# EAGLE design Aeroponics Control (EAGLE 9.6.2)
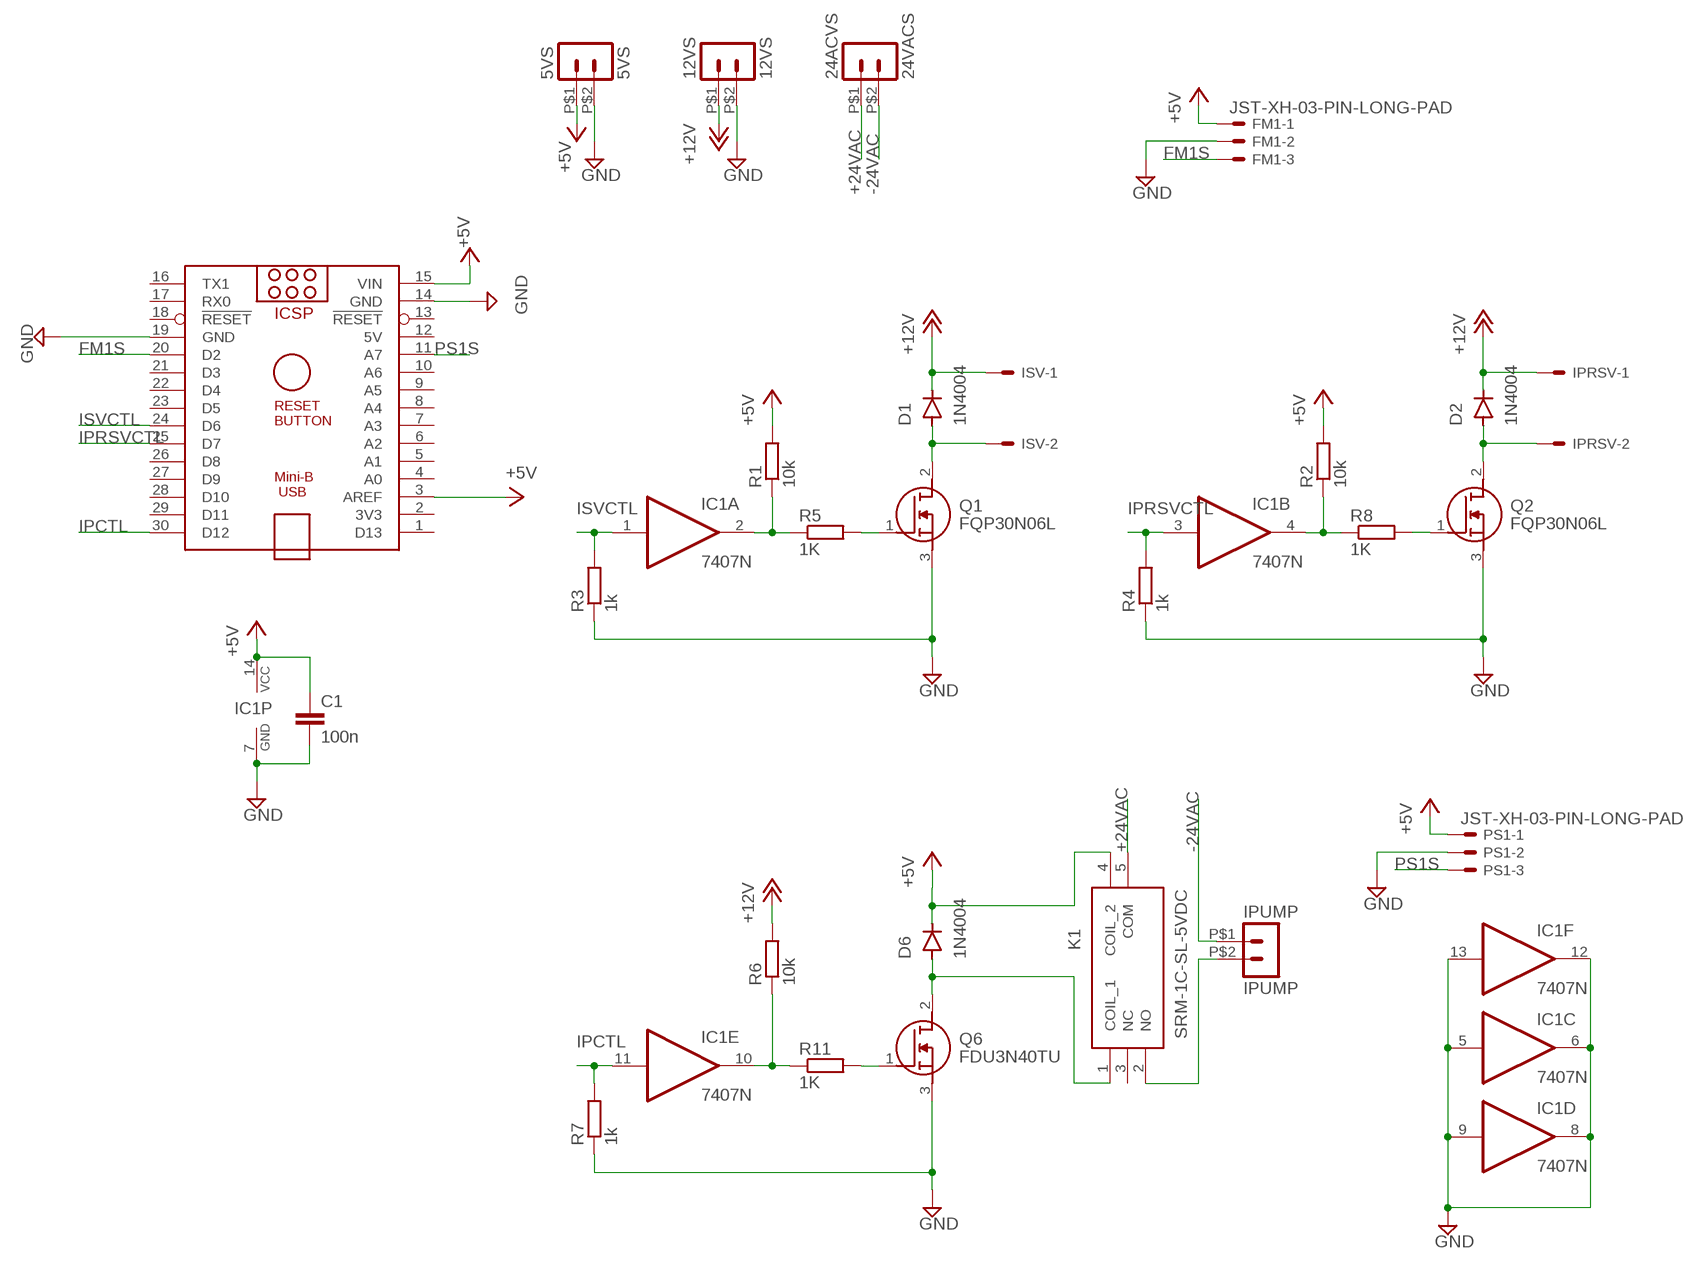
[diagram p0: schematic, sheet 1]

## Parts
5VS  5VS  HEADER_POS2_43650-0215  [43650-0215]
12VS  12VS  HEADER_POS2_43650-0215  [43650-0215]
24ACVS  24VACS  HEADER_POS2_43650-0215  [43650-0215]
C1  100n  C-EU050-024X044  [C050-024X044]
D1  1N4004  [DO-41]
D2  1N4004  [DO-41]
D6  1N4004  [DO-41]
FM1  JST-XH-03-PIN-LONG-PAD  [JST-XH-03-PACKAGE-LONG-PAD]
IC1  7407N  [DIL14]
IPRSV  JST-XH-02-PIN-LONG-PAD  [JST-XH-02-PACKAGE-LONG-PAD]
IPUMP  IPUMP  HEADER_POS2_43650-0215  [43650-0215]
ISV  JST-XH-02-PIN-LONG-PAD  [JST-XH-02-PACKAGE-LONG-PAD]
K1  SRM-1C-SL-5VDC  [SRM1CSL5VDC]
PCB1  ARDUINO_NANOARDUINO_NANO_HEADERS  ARDUINO_NANO  [ARDUINO_NANO]
PS1  JST-XH-03-PIN-LONG-PAD  [JST-XH-03-PACKAGE-LONG-PAD]
Q1  FQP30N06L  [TO254P470X1016X2019-3P]
Q2  FQP30N06L  [TO254P470X1016X2019-3P]
Q6  FDU3N40TU  [TO229P250X658X985-3P]
R1  10k  R-EU_0204/7  [0204/7]
R2  10k  R-EU_0204/7  [0204/7]
R3  1k  R-EU_0204/7  [0204/7]
R4  1k  R-EU_0204/7  [0204/7]
R5  1K  R-EU_0204/7  [0204/7]
R6  10k  R-EU_0204/7  [0204/7]
R7  1k  R-EU_0204/7  [0204/7]
R8  1K  R-EU_0204/7  [0204/7]
R11  1K  R-EU_0204/7  [0204/7]

## Nets
+5V [5V]: 5VS.P$1 C1.1 D6.C FM1.1 IC1.14(P:VCC) K1.4(COIL_2) PCB1.3(AREF) PCB1.15(VIN) PS1.1 R1.2 R2.2
+12V [12V]: 12VS.P$1 D1.C D2.C IPRSV.1 ISV.1 R6.2
+24VAC [24VAC]: 24ACVS.P$1 K1.5(COM)
-24VAC [24VAC]: 24ACVS.P$2 IPUMP.P$1
FM1S: FM1.3 PCB1.20(D2)
GND: 5VS.P$2 12VS.P$2 C1.2 FM1.2 IC1.5(C:I) IC1.6(C:O) IC1.7(P:GND) IC1.8(D:O) IC1.9(D:I) IC1.12(F:O) IC1.13(F:I) PCB1.14(GND) PCB1.19(GND) PS1.2 Q1.3(S) Q2.3(S) Q6.3(S) R3.1 R4.1 R7.1
IPCTL: IC1.11(E:I) PCB1.30(D12) R7.2
IPRSVCTL: IC1.3(B:I) PCB1.25(D7) R4.2
ISVCTL: IC1.1(A:I) PCB1.24(D6) R3.2
N$1 [Solenoids]: D2.A IPRSV.2 Q2.2(D)
N$3: IC1.2(A:O) R1.1 R5.1
N$4: Q2.1(G) R8.2
N$5: Q1.1(G) R5.2
N$7 [24VAC]: IPUMP.P$2 K1.2(NO)
N$9: IC1.4(B:O) R2.1 R8.1
N$10 [Solenoids]: D1.A ISV.2 Q1.2(D)
N$13: Q6.1(G) R11.2
N$17: IC1.10(E:O) R6.1 R11.1
N$21: D6.A K1.1(COIL_1) Q6.2(D)
PS1S: PCB1.11(A7) PS1.3
Unconnected: K1.3(NC) PCB1.1(D13) PCB1.2(3V3) PCB1.4(A0) PCB1.5(A1) PCB1.6(A2) PCB1.7(A3) PCB1.8(A4) PCB1.9(A5) PCB1.10(A6) PCB1.13(!RESET) PCB1.16(TX1) PCB1.17(RX0) PCB1.18(!RESET) PCB1.21(D3) PCB1.22(D4) PCB1.23(D5) PCB1.26(D8) PCB1.27(D9) PCB1.28(D10) PCB1.29(D11)

## Power pins joined to a net without a drawn wire
5V: PCB1.12(5V)

## Library data of the parts
5VS 12VS 24ACVS IPUMP = Aeroponics Control:HEADER_POS2_?: Molex - Micro-Fit 3.0 Series connector, 3.00mm (0.118") pitch header, 2 positions.
C1 = Aeroponics Control:C-EU: CAPACITOR, European symbol
D1 D2 D6 = Aeroponics Control:1N4004: DIODE GEN PURP 400V 1A DO41 Manufacturer's datasheet <https://www.mccsemi.com/pdf/Products/1N4001-1N4007(DO-41).pdf>; CREATED_BY: PCBLayout.com; DIGIKEY_PART_NUMBER: 1N4004MSCT-ND; MANUFACTURER: Micro Commercial Co; MPN: 1N4004; PACKAGE: DO-41
FM1 PS1 = Aeroponics Control:JST-XH-03-PIN: JST XH Connector 2 Pin Wire to board connector. Pitch: 2,54 mm, (0.100") Number of pins: 3 Created by Rembrandt Electronics www.rembrandtelectronics.com
IC1 = Aeroponics Control:74*07: Hex BUFFER, open collector high-voltage output
IPRSV ISV = Aeroponics Control:JST-XH-02-PIN: JST XH Connector 2 Pin Wire to board connector. Pitch: 2,54 mm, (0.100") Number of pins: 2 Created by Rembrandt Electronics www.rembrandtelectronics.com
K1 = Aeroponics Control:SRM-1C-SL-5VDC: IMO PRECISION CONTROLS - SRM-1C-SL-5VDC - RELAY, SPDT, 277VAC, 250VDC, 10A Source: Datasheet <https://componentsearchengine.com/Datasheets/2/SRM-1C-SL-5VDC.pdf>; DESCRIPTION: IMO PRECISION CONTROLS - SRM-1C-SL-5VDC - RELAY, SPDT, 277VAC, 250VDC, 10A; HEIGHT: 15.5mm; MANUFACTURER_NAME: IMO PRECISION CONTROLS; MANUFACTURER_PART_NUMBER: SRM-1C-SL-5VDC
PCB1 = Aeroponics Control:ARDUINO_NANO: Arduino Nano V3.0 Overview: The Arduino Nano is a small, complete, and breadboard-friendly board based on the ATmega328 (Arduino Nano 3.x) or ATmega168 (Arduino Nano 2.x). It has more or less the same functionality of the Arduino Duemilanove, but in a different package. It lacks only a DC power jack, and works with a Mini-B USB cable instead of a standard one. The Nano was designed and is being produced by Gravitech. Specifications: Microcontroller Atmel ATmega168 or ATmega328 Operating Voltage (logic level) 5 V Input Voltage (recommended) 7-12 V Input Voltage (limits) 6-20 V Digital I/O Pins 14 (of which 6 provide PWM output) Analog Input Pins 8 DC Current per I/O Pin 40 mA Flash Memory 16 KB (ATmega168) or 32 KB (ATmega328) of which 2 KB used by bootloader SRAM 1 KB (ATmega168) or 2 KB (ATmega328) EEPROM 512 bytes (ATmega168) or 1 KB (ATmega328) Clock Speed 16 MHz Dimensions 0.73" x 1.70" Length 45 mm Width 18 mm Weigth 5 g Power: The Arduino Nano can be powered via the Mini-B USB connection, 6-20V unregulated external power supply (pin 30), or 5V regulated external power supply (pin 27). The power source is automatically selected to the highest voltage source. Memory: The ATmega168 has 16 KB of flash memory for storing code (of which 2 KB is used for the bootloader); the ATmega328 has 32 KB, (also with 2 KB used for the bootloader). The ATmega168 has 1 KB of SRAM and 512 bytes of EEPROM (which can be read and written with the EEPROM library); the ATmega328 has 2 KB of SRAM and 1 KB of EEPROM. Input and Output: Each of the 14 digital pins on the Nano can be used as an input or output, using pinMode(), digitalWrite(), and digitalRead() functions. They operate at 5 volts. Each pin can provide or receive a maximum of 40 mA and has an internal pull-up resistor (disconnected by default) of 20-50 kOhms. In addition, some pins have specialized functions. Visit Arduino - ArduinoBoardNano <https://www.arduino.cc/en/Main/ArduinoBoardNano>
Q1 Q2 = Aeroponics Control:FQP30N06L: FQP30N06L N-Channel MOSFET, 32 A, 60 V QFET, 3-Pin TO-220 ON Semiconductor Source: Datasheet <http://uk.rs-online.com/web/p/products/8075863P>; DESCRIPTION: FQP30N06L N-Channel MOSFET, 32 A, 60 V QFET, 3-Pin TO-220 ON Semiconductor; HEIGHT: 4.7mm; MANUFACTURER_NAME: onsemi; MANUFACTURER_PART_NUMBER: FQP30N06L; RS_PART_NUMBER: 8075863P; RS_PRICE-STOCK: http://uk.rs-online.com/web/p/products/8075863P
Q6 = Aeroponics Control:FDU3N40TU: Fairchild FDU3N40TU N-channel MOSFET Transistor, 2 A, 400 V, 3-Pin IPAK Source: Datasheet <http://uk.rs-online.com/web/p/products/8070701P>; DESCRIPTION: Fairchild FDU3N40TU N-channel MOSFET Transistor, 2 A, 400 V, 3-Pin IPAK; HEIGHT: 2.5mm; MANUFACTURER_NAME: onsemi; MANUFACTURER_PART_NUMBER: FDU3N40TU; RS_PART_NUMBER: 8070701P; RS_PRICE-STOCK: http://uk.rs-online.com/web/p/products/8070701P
R1-R8 R11 = Aeroponics Control:R-EU_: RESISTOR, European symbol

## Net classes
0 default: width 0.203 mm, clearance 0.254 mm
1 240VAC: width 0.254 mm, drill 0.254 mm, clearance 0.508 mm to class 0, clearance 0.508 mm
2 24VAC: width 0.762 mm, drill 0.762 mm, clearance 0.508 mm to class 0, clearance 0.508 mm to class 1, clearance 0.508 mm
3 5V: width 0.508 mm, drill 0.508 mm, clearance 0.254 mm to class 0, clearance 0.254 mm to class 1, clearance 0.254 mm to class 2, clearance 0.254 mm
4 12V: width 2.032 mm, drill 2.032 mm, clearance 0.254 mm to class 0, clearance 0.254 mm to class 1, clearance 0.254 mm to class 2, clearance 0.254 mm to class 3, clearance 0.254 mm
5 Pumps: width 0.762 mm, drill 0.762 mm, clearance 0.254 mm to class 0, clearance 0.254 mm to class 1, clearance 0.254 mm to class 2, clearance 0.254 mm to class 3, clearance 0.254 mm to class 4, clearance 0.254 mm
6 Solenoids: width 0.254 mm, drill 0.254 mm, clearance 0.254 mm to class 0, clearance 0.254 mm to class 1, clearance 0.254 mm to class 2, clearance 0.254 mm to class 3, clearance 0.254 mm to class 4, clearance 0.254 mm to class 5, clearance 0.254 mm

## Board
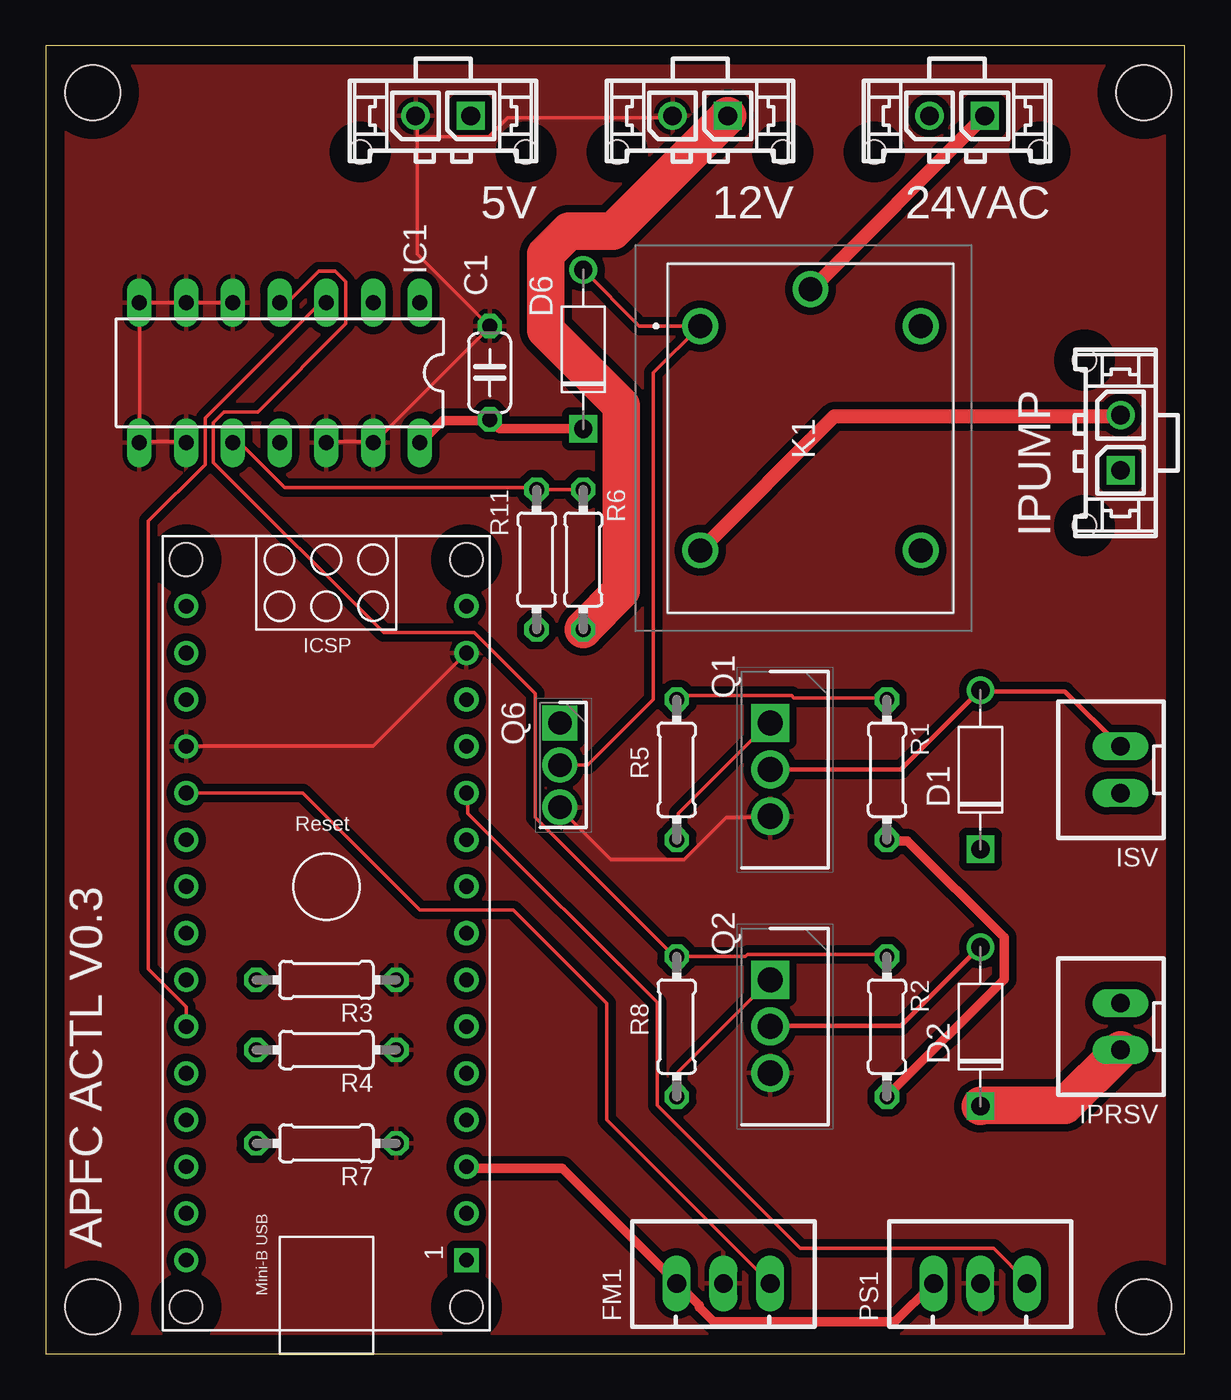
[diagram p1: board, top side]
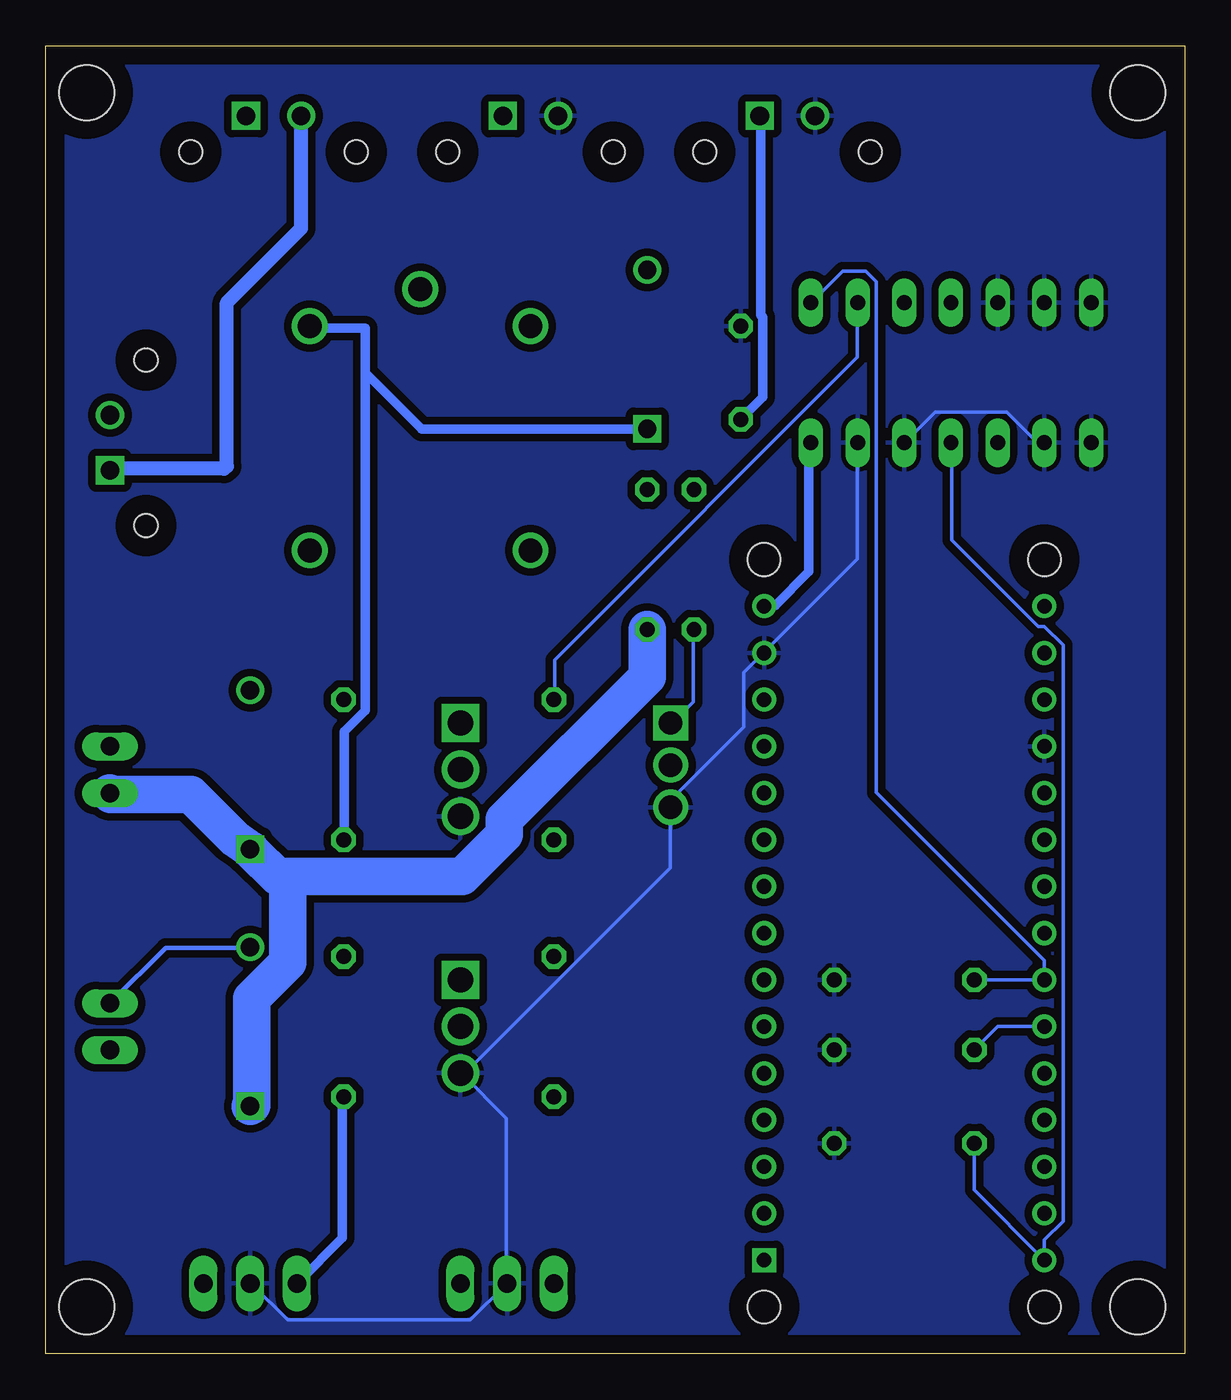
[diagram p2: board, bottom side, seen from below]

Size 61.9 x 71.11 mm. Coordinates in mm from the lower left corner, seen from the top.
Outline: 0,0 61.9,0 61.9,71.11 0,71.11 0,0
Copper layers (1*16): Top 0.035mm / dielectric 1.5mm / Bottom 0.035mm
Design rules "default": minimum track width 6mil, minimum drill 0.35mm, track to track 6mil, track to pad 6mil, pad to pad 6mil, via to via 6mil, smd to smd 6mil, copper to edge 40mil, drill to drill 6mil, minimum pad ring 10mil, minimum via ring 8mil, stop-mask expansion 4mil, vias tented up to drill 0mil, thermal gap 10mil
Holes 3 mm at 2.54,68.58 59.69,68.58 59.69,2.54 2.54,2.54

### Footprints (pad centres in the part's own frame; a part is rotated, then mirrored left to right if it is on the bottom)
43650-0215 = drill 1.02 square: P$1 1.5,0 | drill 1.02: P$2 -1.5,0 | hole 1.27: 4.5,-1.96; -4.5,-1.96
C050-024X044 = drill 0.813 octagon: 1 -2.54,0; 2 2.54,0
DO-41 = drill 1: A 4.325,0 | drill 1 square: C -4.325,0
JST-XH-03-PACKAGE-LONG-PAD = drill 1.016 long: 1 -2.54,0; 2 0,0; 3 2.54,0
DIL14 = drill 0.813 long: 1 -7.62,-3.81; 2 -5.08,-3.81; 3 -2.54,-3.81; 4 0,-3.81; 5 2.54,-3.81; 6 5.08,-3.81; 7 7.62,-3.81; 8 7.62,3.81; 9 5.08,3.81; 10 2.54,3.81; 11 0,3.81; 12 -2.54,3.81; 13 -5.08,3.81; 14 -7.62,3.81
JST-XH-02-PACKAGE-LONG-PAD = drill 1.016 long: 1 -1.27,0; 2 1.27,0
SRM1CSL5VDC = drill 1.3 pad 1.95: 1 0,0; 2 12.2,0; 3 12.2,12; 4 0,12; 5 -2,6
ARDUINO_NANO = drill 0.8 square: 1 -20.32,-7.62 | drill 0.8: 2 -17.78,-7.62; 3 -15.24,-7.62; 4 -12.7,-7.62; 5 -10.16,-7.62; 6 -7.62,-7.62; 7 -5.08,-7.62; 8 -2.54,-7.62; 9 0,-7.62; 10 2.54,-7.62; 11 5.08,-7.62; 12 7.62,-7.62; 13 10.16,-7.62; 14 12.7,-7.62; 15 15.24,-7.62; 16 15.24,7.62; 17 12.7,7.62; 18 10.16,7.62; 19 7.62,7.62; 20 5.08,7.62; 21 2.54,7.62; 22 0,7.62; 23 -2.54,7.62; 24 -5.08,7.62; 25 -7.62,7.62; 26 -10.16,7.62; 27 -12.7,7.62; 28 -15.24,7.62; 29 -17.78,7.62; 30 -20.32,7.62 | hole 1.778: -22.86,-7.62; -22.86,7.62; 17.78,7.62; 17.78,-7.62
TO254P470X1016X2019-3P = drill 1.37 pad 2.055 square: 1 0,0 | drill 1.37 pad 2.055: 2 2.535,0; 3 5.07,0
TO229P250X658X985-3P = drill 1.27 pad 1.905 square: 1 0,0 | drill 1.27 pad 1.905: 2 2.29,0; 3 4.58,0
0204/7 = drill 0.813 octagon: 1 -3.81,0; 2 3.81,0

### Placement (x,y rotation side)
5VS  21.59,67.31 0 top
12VS  35.56,67.31 0 top
24ACVS  49.53,67.31 0 top
C1  24.13,53.34 90 top
D1  50.8,31.75 90 top
D2  50.8,17.78 90 top
D6  29.21,54.61 90 top
FM1  36.83,3.81 0 top
IC1  12.7,53.34 180 top
IPRSV  58.42,17.78 90 top
IPUMP  58.42,49.53 270 top
ISV  58.42,31.75 90 top
K1  35.56,55.88 270 top
PCB1  15.24,25.4 90 top
PS1  50.8,3.81 0 top
Q1  39.37,34.29 270 top
Q2  39.37,20.32 270 top
Q6  27.94,34.29 270 top
R1  45.72,31.75 270 top
R2  45.72,17.78 270 top
R3  15.24,20.32 180 top
R4  15.24,16.51 180 top
R5  34.29,31.75 270 top
R6  29.21,43.18 270 top
R7  15.24,11.43 180 top
R8  34.29,17.78 270 top
R11  26.67,43.18 270 top

### Tracks (layer width: path | path; a pad name or v marks a point on that pad's centre or on a via)
+5V
  Top 0.508: PCB1.3 22.94,10.06 28.08,10.06 34.25,3.89 FM1.1 34.48,3.66 35.51,2.63 35.51,2.52 36.31,1.71 46.14,1.71 48.2,3.77 PS1.1 | R1.2 45.8,27.89 46.82,27.89 52.08,22.63 52.08,20.34 45.8,14.06 R2.2 | IC1.14 20.42,49.61 21.56,50.75 24.08,50.75 C1.1 24.31,50.63 24.65,50.29 29.11,50.29 D6.C
  Bottom 0.508: R2.2 45.8,13.95 45.8,6.29 48.2,3.89 PS1.1 | PCB1.15 22.82,40.69 22.25,40.69 20.42,42.52 20.42,49.49 IC1.14 | 5VS.P$1 23.05,67.21 23.05,56.46 22.94,56.35 22.94,52.01 24.08,50.86 C1.1 | K1.4 47.51,55.78 44.54,55.78 44.54,55.55 44.54,53.34 | 44.54,53.34 44.54,34.98 45.68,33.83 45.68,28 R1.2 | D6.C 41.48,50.28 44.54,53.34
+12V
  Top 2.032: D2.C 50.82,13.49 55.4,13.49 58.37,16.46 IPRSV.1 | 12VS.P$1 36.99,67.21 30.82,61.04 28.42,61.04 27.16,59.78 27.16,55.66 31.28,51.55 31.28,41.49 29.22,39.43 R6.2
  Bottom 2.032: 48.77,25.95 49.34,25.95 50.71,27.32 D1.C 51.62,28 54.03,30.4 58.37,30.4 ISV.1 | 48.77,25.95 39.28,25.95 36.99,28.23 36.99,29.03 29.22,36.8 29.22,39.32 R6.2 | D2.C 50.71,13.49 50.71,19.32 48.77,21.26 48.77,25.03 48.77,25.95
+24VAC
  Top 0.762: 24ACVS.P$1 50.94,67.21 41.57,57.84 K1.5
-24VAC
  Bottom 0.762: IPUMP.P$1 58.37,48.12 52.21,48.12 52.07,48.26 52.07,57.15 48.03,61.19 24ACVS.P$2
FM1S
  Top 0.203: PCB1.20 13.97,30.48 20.32,24.13 25.4,24.13 30.48,19.05 30.48,12.7 FM1.3
GND
  Top 0.203: 5.1,49.61 7.62,49.61 IC1.9 | 5.1,49.61 IC1.8 5.1,49.61 | 5.1,57.15 IC1.6 10.13,57.15 IC1.5 | 5.1,57.15 IC1.7 5.1,57.15 | 5.1,57.15 5.1,49.61 | IC1.12 15.28,49.61 17.68,49.61 IC1.13 17.79,49.49 24.08,55.78 C1.2 24.08,55.89 20.19,59.78 20.19,66.18 | 20.19,66.18 20.19,67.21 5VS.P$2 | 20.19,66.18 24.08,66.18 25.11,67.21 34.02,67.21 12VS.P$2 | PCB1.19 7.62,33.03 17.79,33.03 22.82,38.06 PCB1.14 | Q1.3 39.28,29.15 36.99,29.15 34.71,26.86 30.71,26.86 27.96,29.6 Q6.3
  Bottom 0.203: IC1.9 7.62,49.61 8.08,49.61 9.68,51.21 13.56,51.21 15.16,49.61 IC1.12 | PS1.2 50.71,3.77 48.77,1.83 38.82,1.83 36.88,3.77 FM1.2 36.88,3.89 36.88,12.8 39.28,15.2 Q2.3 39.17,15.2 27.96,26.4 27.96,29.6 Q6.3 27.85,29.72 27.85,30.18 23.96,34.06 23.96,37.03 22.94,38.06 PCB1.14 22.82,38.18 17.79,43.2 17.79,49.49 IC1.13
  pour Top (isolate 0.406): 0,71.12 62.23,71.12 62.23,0 0,0
  pour Bottom (isolate 0.406): 0,71.12 62.23,71.12 62.23,0 0,0
IPCTL
  Bottom 0.203: IC1.11 12.65,49.49 12.65,44.23 7.96,39.55 7.62,39.55 6.59,38.52 6.59,7.2 7.62,6.17 7.62,5.14 PCB1.30 11.43,8.89 R7.2
IPRSVCTL
  Top 0.203: PCB1.25 7.62,17.83 7.62,18.86 5.56,20.92 5.56,45.26 8.65,48.35 8.65,50.86 14.93,57.15 15.16,57.15 IC1.3
  Bottom 0.203: PCB1.25 10.16,17.78 R4.2
ISVCTL
  Bottom 0.203: IC1.1 20.31,57.15 18.59,58.86 17.34,58.86 16.76,58.29 16.76,30.52 7.62,21.37 7.62,20.34 PCB1.24 R3.2
N$1
  Top 0.254: Q2.2 39.4,17.83 46.48,17.83 50.71,22.06 D2.A
  Bottom 0.254: D2.A 50.82,22.06 55.4,22.06 58.37,19.09 IPRSV.2
N$3
  Top 0.203: R1.1 45.68,35.66 40.65,35.66 40.54,35.78 34.48,35.78 34.37,35.66 R5.1
  Bottom 0.203: IC1.2 17.79,57.15 17.79,54.18 34.25,37.72 34.25,35.66 R5.1
N$4
  Top 0.203: R8.2 34.37,14.06 34.37,15.32 39.28,20.23 Q2.1
N$5
  Top 0.203: R5.2 34.37,28 34.37,29.38 39.28,34.29 Q1.1
N$7
  Top 0.762: IPUMP.P$2 58.37,50.98 42.86,50.98 K1.2
N$9
  Top 0.203: R2.1 45.68,21.6 45.57,21.72 38.14,21.72 38.02,21.6 34.37,21.6 R8.1 34.25,21.49 26.59,29.15 26.59,35.89 23.28,39.2 18.36,39.2 9.11,48.46 9.11,50.63 9.68,51.21 11.51,51.21 16.31,56.01 16.31,58.29 15.73,58.86 14.82,58.86 13.11,57.15 12.76,57.15 IC1.4
N$10
  Top 0.254: ISV.2 58.37,33.03 55.4,36.01 50.82,36.01 D1.A 50.71,36.01 46.48,31.77 39.4,31.77 Q1.2
N$13
  Bottom 0.203: R11.2 26.71,39.32 26.71,35.43 27.85,34.29 Q6.1
N$17
  Top 0.203: R6.1 29.11,46.98 26.71,46.98 R11.1 26.59,47.09 12.99,47.09 10.59,49.49 10.25,49.49 IC1.10
N$21
  Top 0.203: Q6.2 29.46,32 33.02,35.56 33.02,53.34 K1.1 32.26,55.88 D6.A
PS1S
  Top 0.203: PCB1.11 22.94,30.4 22.94,29.38 33.22,19.09 33.22,13.49 41,5.71 51.51,5.71 53.34,3.89 PS1.3

### Text on the board
tNames: 5V | 12V | 24VAC | IPUMP | APFC ACTL V0.3